# EAGLE schematic opt-lasercutter (EAGLE 9.0.0)
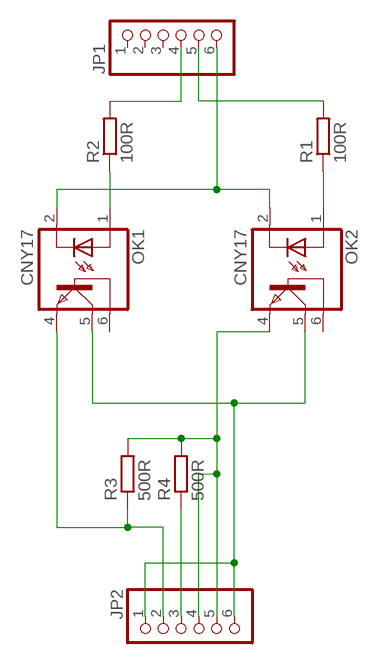
[diagram p0: schematic, sheet 1]

## Parts
JP1  PINHD-1X6/90  [1X06/90]
JP2  PINHD-1X6/90  [1X06/90]
OK1  CNY17  [DIL06]
OK2  CNY17  [DIL06]
R1  100R  R-EU_0207/7  [0207/7]
R2  100R  R-EU_0207/7  [0207/7]
R3  500R  R-EU_0207/7  [0207/7]
R4  500R  R-EU_0207/7  [0207/7]

## Nets
N$1: JP1.6 OK1.2(C) OK2.2(C)
N$3: JP1.5 R1.2
N$4: OK2.1(A) R1.1
N$5: JP1.4 R2.2
N$6: OK1.1(A) R2.1
N$7: JP2.1 JP2.6 OK1.5(COL) OK2.5(COL)
N$8: JP2.4 JP2.5 OK2.4(EMI) R3.2 R4.2
N$9: JP2.3 R4.1
N$10: JP2.2 OK1.4(EMI) R3.1
Unconnected: JP1.1 JP1.2 JP1.3 OK1.6(BAS) OK2.6(BAS)

## Library data of the parts
JP1 JP2 = pinhead:PINHD-1X6: PIN HEADER
OK1 OK2 = optocoupler:CNY17: SIEMENS OPTO COUPLER; MPN: CNY17-1; OC_FARNELL: 1045399; OC_NEWARK: 05M4044
R1-R4 = rcl:R-EU_: RESISTOR, European symbol; SPICEPREFIX: R